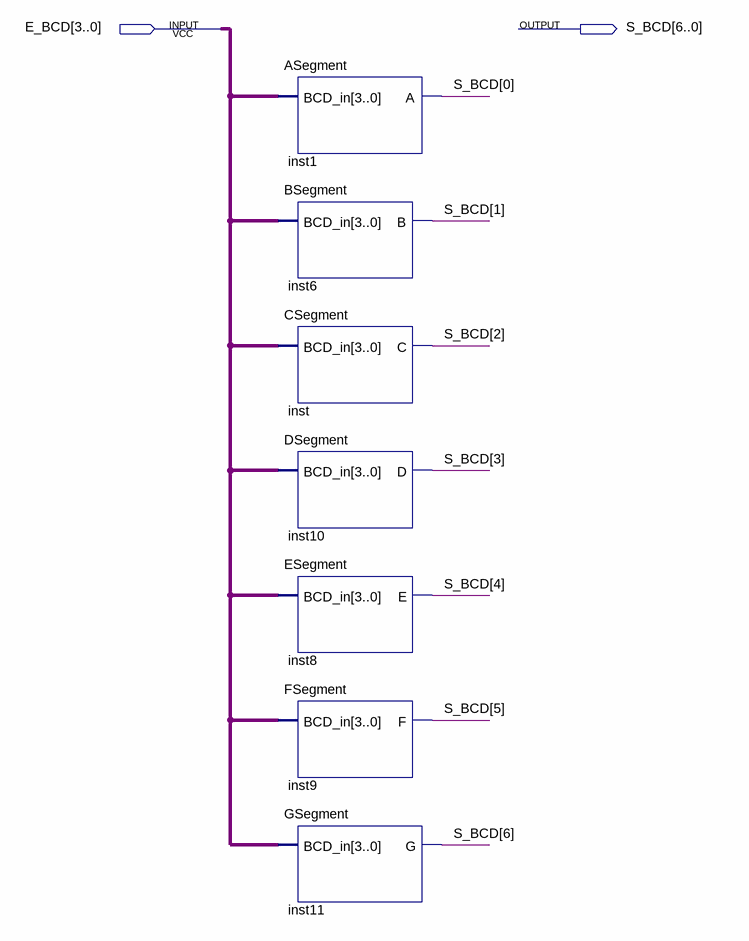
[diagram p0: schematic sheet]
// Quartus schematic BCD_Decoder.bdf as structural Verilog: 7 symbols, 2 pins
module BCD_Decoder (
  input  [3:0] E_BCD,
  output [6:0] S_BCD
);

  ASegment inst1 (.BCD_in(E_BCD), .A(S_BCD[0]));
  BSegment inst6 (.BCD_in(E_BCD), .B(S_BCD[1]));
  CSegment inst (.BCD_in(E_BCD), .C(S_BCD[2]));
  DSegment inst10 (.BCD_in(E_BCD), .D(S_BCD[3]));
  ESegment inst8 (.BCD_in(E_BCD), .E(S_BCD[4]));
  FSegment inst9 (.BCD_in(E_BCD), .F(S_BCD[5]));
  GSegment inst11 (.BCD_in(E_BCD), .G(S_BCD[6]));
endmodule
